# EAGLE design echo-we (EAGLE 7.5.0)
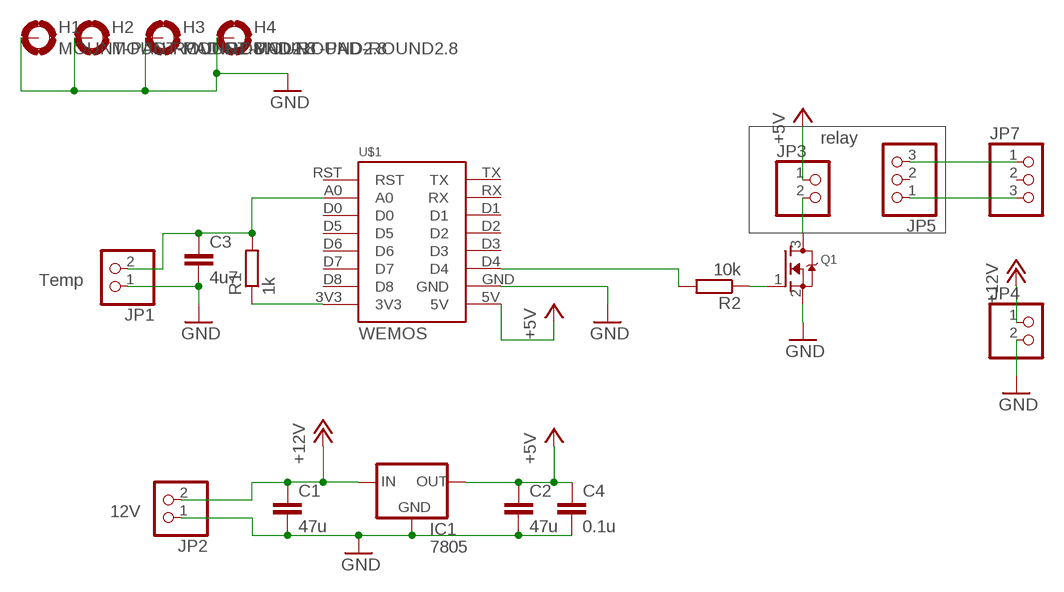
[diagram p0: schematic, sheet 1]

## Parts
C1  47u  C-EUC1206  [C1206]
C2  47u  C-EUC1206  [C1206]
C3  4u7  C-EUC1206  [C1206]
C4  0.1u  C-EUC1206  [C1206]
H1  MOUNT-PAD-ROUND2.8  [2,8-PAD]
H2  MOUNT-PAD-ROUND2.8  [2,8-PAD]
H3  MOUNT-PAD-ROUND2.8  [2,8-PAD]
H4  MOUNT-PAD-ROUND2.8  [2,8-PAD]
IC1  7805  78XXS  [78XXS]
JP1  PINHD-1X2  [1X02]
JP2  PINHD-1X2  [1X02]
JP3  PINHD-1X2  [1X02]
JP4  PINHD-1X2  [1X02]
JP5  PINHD-1X3  [1X03]
JP7  PINHD-1X3  [1X03]
Q1  MOSFET-NREFLOW  [SOT23]
R1  1k  R-EU_R0805  [R0805]
R2  10k  R-EU_R0805  [R0805]
U$1  WEMOS  [WEMOS]

## Nets
+5V: C2.1 C4.1 IC1.OUT JP3.1 U$1.5V
+12V: C1.1 IC1.IN JP2.2 JP4.1
GND: C1.2 C2.2 C3.2 C4.2 H1.B2,8(MOUNT) H2.B2,8(MOUNT) H3.B2,8(MOUNT) H4.B2,8(MOUNT) IC1.GND JP1.1 JP2.1 JP4.2 Q1.2(S) U$1.GND
N$1: R1.1 U$1.3V3
N$2: C3.1 JP1.2 R1.2 U$1.A0
N$3: JP5.3 JP7.1
N$4: JP5.1 JP7.3
N$5: R2.2 U$1.D4
N$6: Q1.1(G) R2.1
N$7: JP3.2 Q1.3(D)
Unconnected: JP5.2 JP7.2 U$1.D0 U$1.D1 U$1.D2 U$1.D3 U$1.D5 U$1.D6 U$1.D7 U$1.D8 U$1.RST U$1.RX U$1.TX

## Notes on the sheet
- relay
- Temp
- 12V

## Library data of the parts
C1-C4 = rcl:C-EU: CAPACITOR, European symbol
H1-H4 = holes:MOUNT-PAD-ROUND: MOUNTING PAD, round
IC1 = v-reg:78XXS: VOLTAGE REGULATOR
JP1-JP4 = pinhead:PINHD-1X2: PIN HEADER
JP5 JP7 = pinhead:PINHD-1X3: PIN HEADER
Q1 = adafruit:MOSFET-N: N-Channel Mosfet 2N7002E - 60V 260mA SOT23 [Digikey: 2N7002ET1GOSTR-ND] - REEL BSH103 - 30V 850mA SOT23 [Digikey: 568-5013-1-ND]
R1 R2 = rcl:R-EU_: RESISTOR, European symbol
U$1 = 1455413453956-wemos:WEMOS

## Board
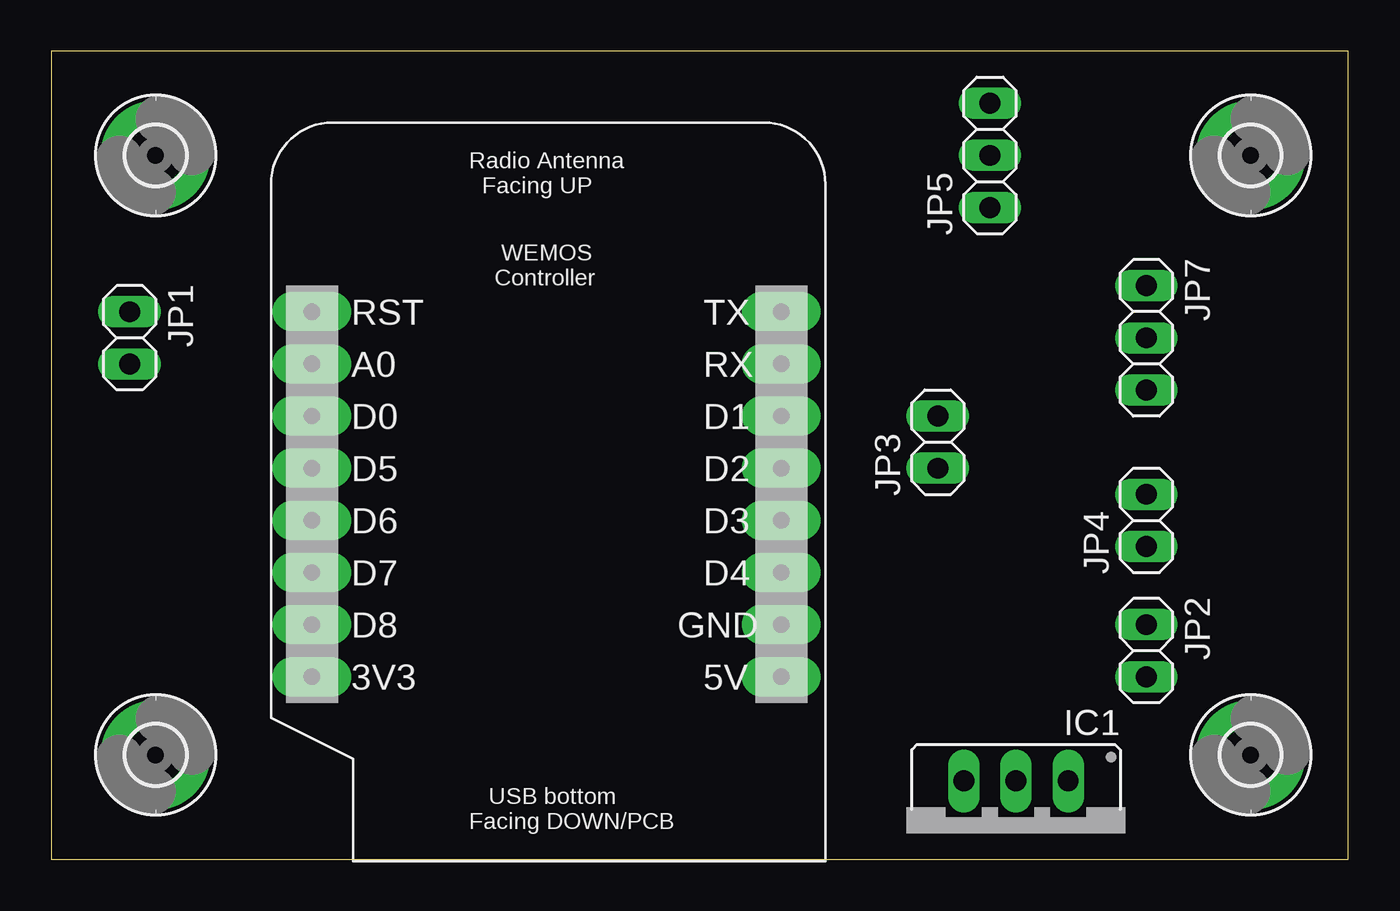
[diagram p1: board, top side]
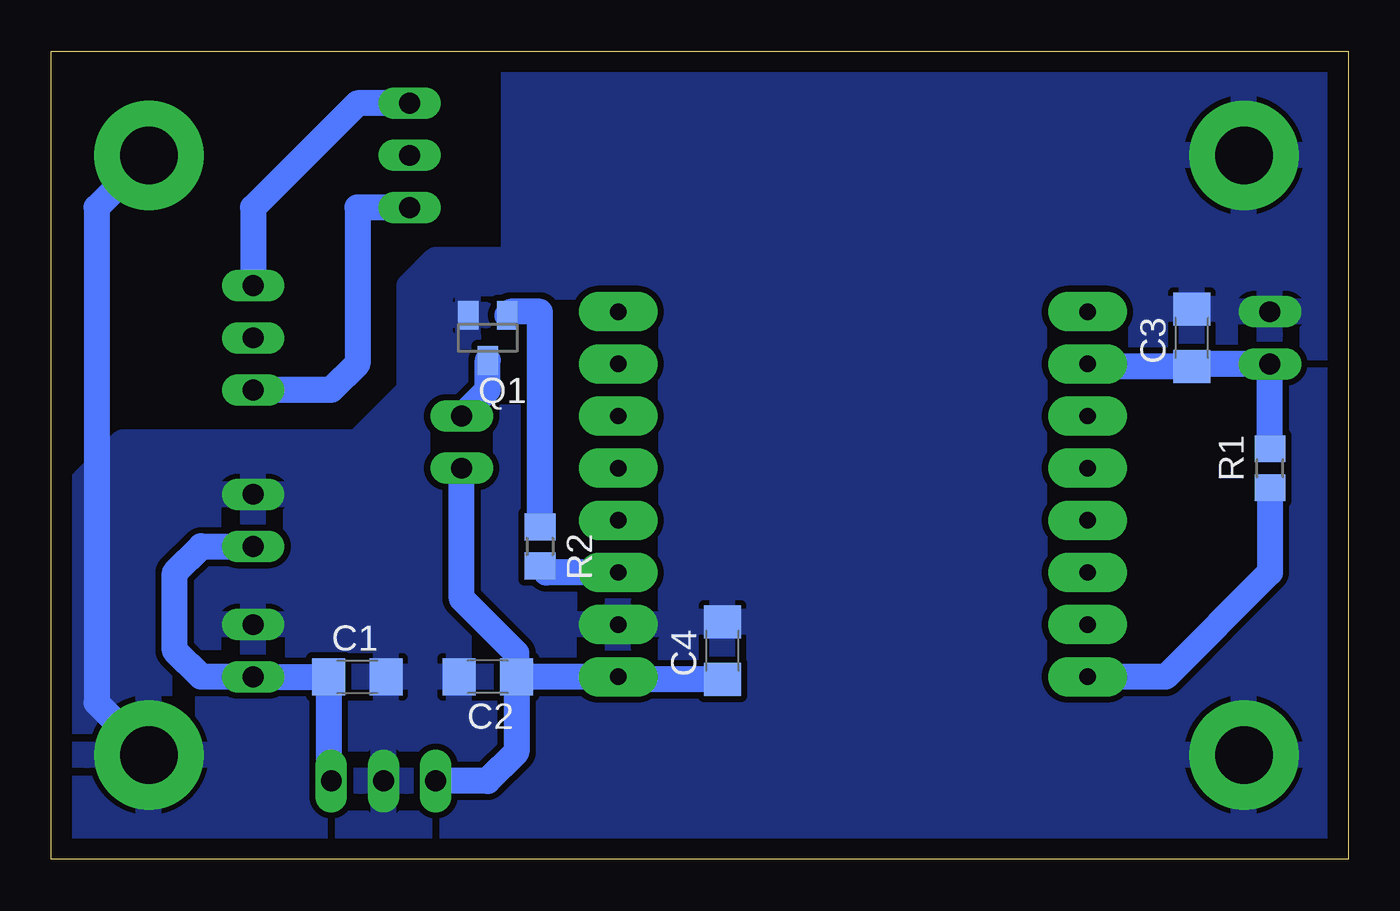
[diagram p2: board, bottom side, seen from below]

Size 63.17 x 39.36 mm. Coordinates in mm from the lower left corner, seen from the top.
Outline: 0,0 63.17,0 63.17,39.36 0,39.36 0,0
Copper layers (1*16): Top 0.035mm / dielectric 1.5mm / Bottom 0.035mm
Design rules "default *": minimum track width 10mil, minimum drill 24mil, track to track 12mil, track to pad 12mil, pad to pad 12mil, via to via 12mil, smd to smd 12mil, copper to edge 40mil, drill to drill 12mil, minimum pad ring 10mil, minimum via ring 8mil, stop-mask expansion 4mil, vias tented up to drill 0mil, thermal gap 10mil

### Footprints (pad centres in the part's own frame; a part is rotated, then mirrored left to right if it is on the bottom)
C1206 = smd 1.6 x 1.8: 1 -1.4,0; 2 1.4,0
2,8-PAD = drill 2.8 pad 5.334: B2,8 0,0
78XXS = drill 1.016 long: GND 0,-2.54; IN -2.54,-2.54; OUT 2.54,-2.54
1X02 = drill 1.016 long: 1 -1.27,0; 2 1.27,0
1X03 = drill 1.016 long: 1 -2.54,0; 2 0,0; 3 2.54,0
SOT23 = smd 1 x 1.4: 1 -0.95,-1.1; 2 0.95,-1.1; 3 0,1.1
R0805 = smd 1.3 x 1.5: 1 -0.95,0; 2 0.95,0
WEMOS = drill 0.8 pad 1.93 long: 3V3 0,0; 5V 22.86,0; A0 0,15.24; D0 0,12.7; D1 22.86,12.7; D2 22.86,10.16; D3 22.86,7.62; D4 22.86,5.08; D5 0,10.16; D6 0,7.62; D7 0,5.08; D8 0,2.54; GND 22.86,2.54; RST 0,17.78; RX 22.86,15.24; TX 22.86,17.78

### Placement (x,y rotation side)
C1  48.26,8.89 0 bottom
C2  41.91,8.89 180 bottom
C3  7.62,25.4 90 bottom
C4  30.48,10.16 90 bottom
H1  58.42,34.29 0 top
H2  58.42,5.08 0 top
H3  5.08,5.08 0 top
H4  5.08,34.29 0 top
IC1  46.99,1.27 180 top
JP1  3.81,25.4 270 top
JP2  53.34,10.16 270 top
JP3  43.18,20.32 90 top
JP4  53.34,16.51 90 top
JP5  45.72,34.29 90 top
JP7  53.34,25.4 270 top
Q1  41.91,25.4 180 bottom
R1  3.81,19.05 90 bottom
R2  39.37,15.24 270 bottom
U$1  12.7,8.89 0 top

### Tracks (layer width: path | path; a pad name or v marks a point on that pad's centre or on a via)
+5V
  Bottom 1.27: C4.1 35.43,8.76 U$1.5V C2.1 | C2.1 40.51,5.21 41.91,3.81 IC1.OUT | C2.1 40.51,10.03 43.18,12.7 JP3.1
+12V
  Bottom 1.27: IC1.IN 49.66,3.94 C1.1 JP2.2 55.88,8.89 57.15,10.16 57.15,13.97 55.88,15.24 JP4.1
GND
  Bottom 1.27: H1.B2,8 60.96,31.75 60.96,7.62 H2.B2,8
  pour Bottom: 40.64,30.48 40.64,39.37 0,39.37 0,0 63.5,0 63.5,16.51 59.69,20.32 48.26,20.32 45.72,22.86 45.72,27.94 44.45,29.21 40.64,29.21
N$1
  Bottom 1.27: R1.1 3.81,13.97 8.89,8.89 U$1.3V3
N$2
  Bottom 1.27: R1.2 JP1.2 7.49,24.13 C3.1 12.57,24 U$1.A0
N$3
  Bottom 1.27: JP5.3 48.26,36.83 53.34,31.75 JP7.1
N$4
  Bottom 1.27: JP5.1 48.26,31.75 48.26,24.13 49.53,22.86 JP7.3
N$5
  Bottom 1.27: U$1.D4 39.05,13.97 R2.2
N$6
  Bottom 1.27: R2.1 39.37,26.67 40.79,26.67 Q1.1
N$7
  Bottom 1.27: JP3.2 41.91,22.86 Q1.3